# EAGLE design Adafruit IS31FL3731 STEMMA QT (EAGLE 9.6.2)
COMPANY: ADAFRUIT INDUSTRIES; DRAWN: KTOWN; REV: A
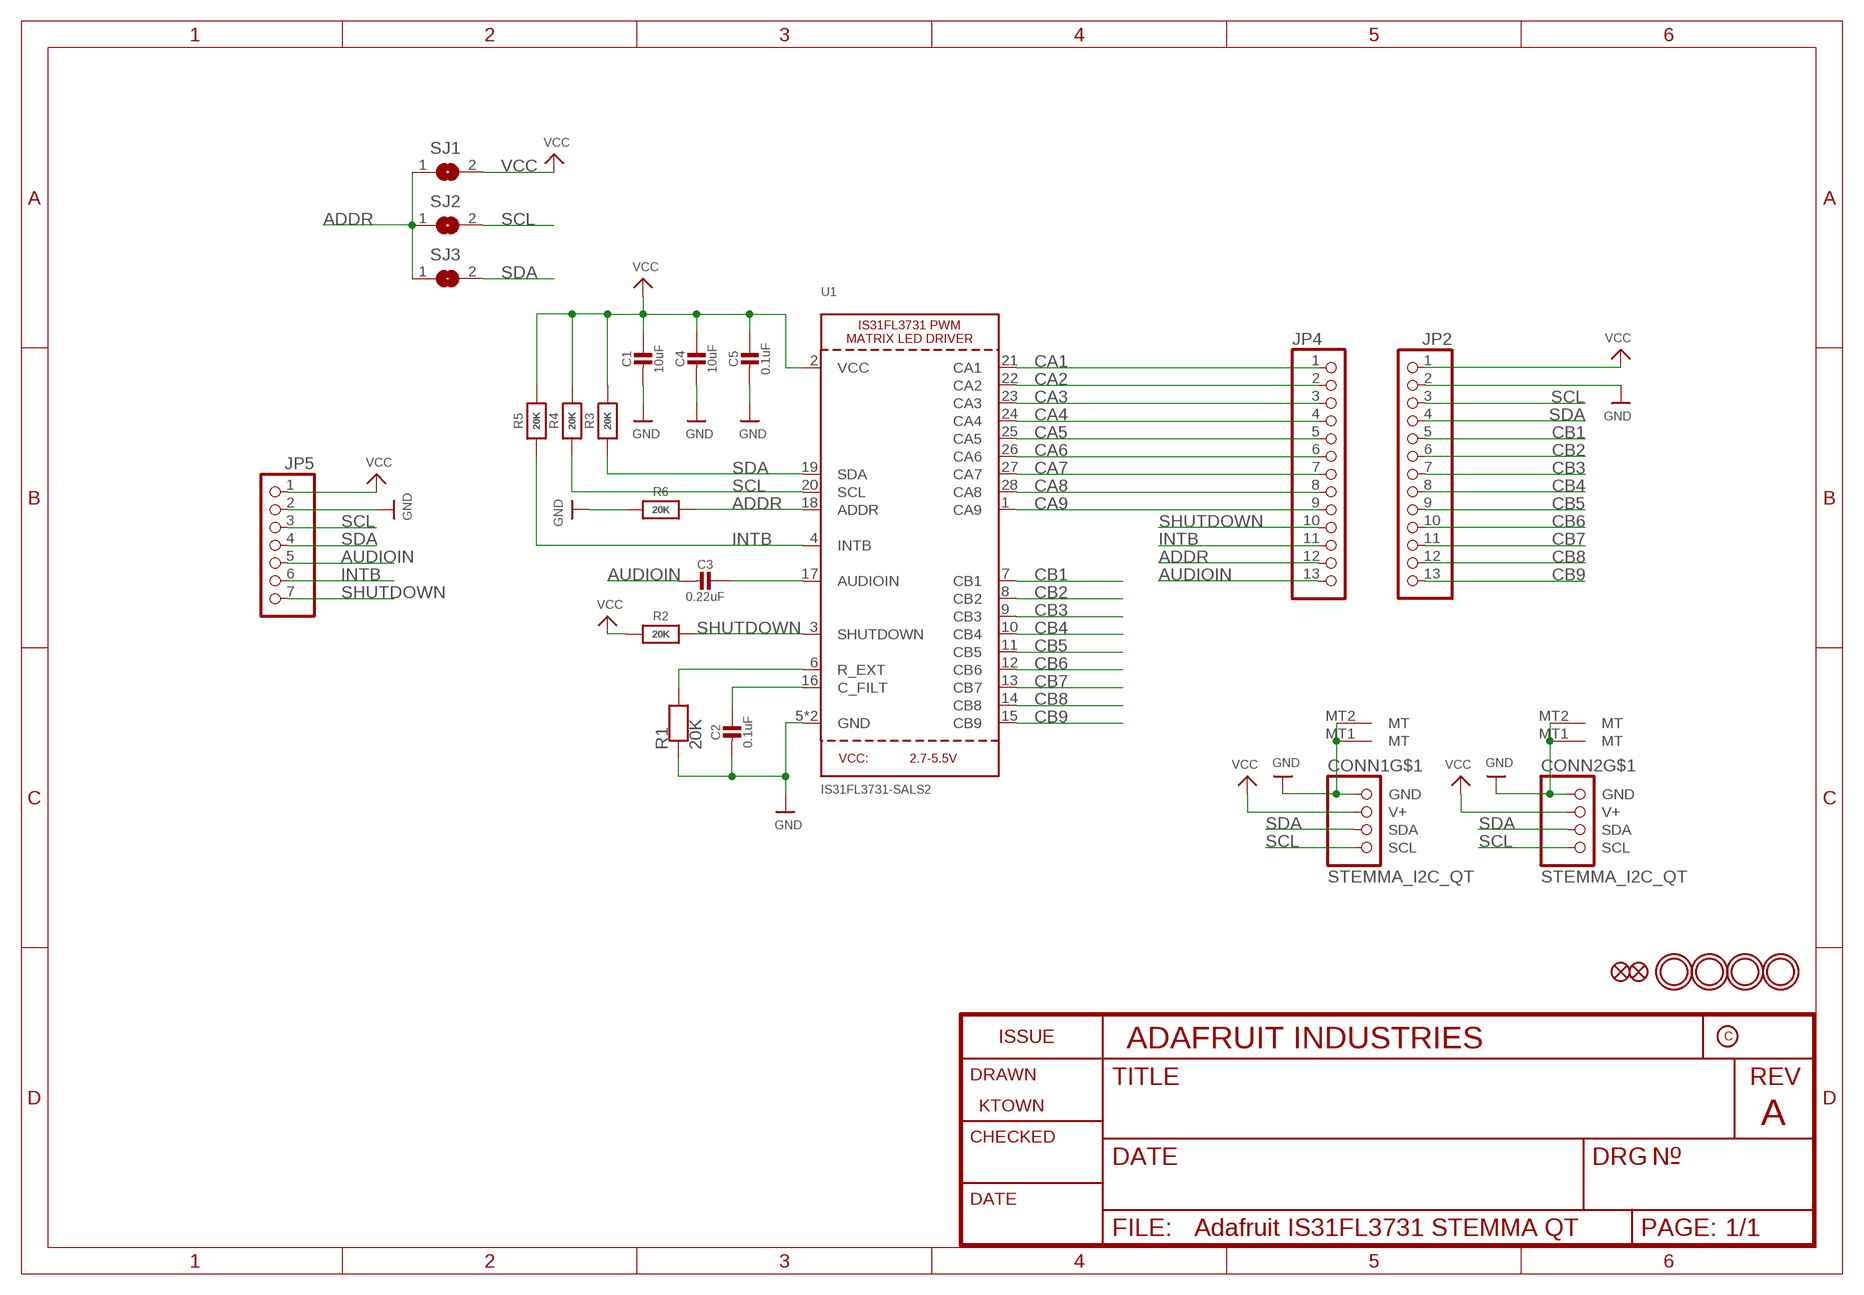
[diagram p0: schematic, sheet 1]

## Parts
C1  10uF  CAP_CERAMIC0805-NOOUTLINE  [0805-NO]
C2  0.1uF  CAP_CERAMIC0603_NO  [0603-NO]
C3  0.22uF  CAP_CERAMIC0603_NO  [0603-NO]
C4  10uF  CAP_CERAMIC0805-NOOUTLINE  [0805-NO]
C5  0.1uF  CAP_CERAMIC0603_NO  [0603-NO]
CONN1  STEMMA_I2C_QT  [JST_SH4]
CONN2  STEMMA_I2C_QT  [JST_SH4]
FID1  FIDUCIAL_1MM  [FIDUCIAL_1MM]
FID2  FIDUCIAL_1MM  [FIDUCIAL_1MM]
JP2  HEADER-1X13  [1X13_ROUND_70]
JP4  HEADER-1X13  [1X13_ROUND_70]
JP5  HEADER-1X7THICKER  [1X07_ROUND_76]
R1  20K  RESISTOR_0603THM  [0603-THM]
R2  20K  RESISTOR_0603_NOOUT  [0603-NO]
R3  20K  RESISTOR_0603_NOOUT  [0603-NO]
R4  20K  RESISTOR_0603_NOOUT  [0603-NO]
R5  20K  RESISTOR_0603_NOOUT  [0603-NO]
R6  20K  RESISTOR_0603_NOOUT  [0603-NO]
SJ1  SOLDERJUMPER  [SOLDERJUMPER_ARROW_NOPASTE]
SJ2  SOLDERJUMPER  [SOLDERJUMPER_ARROW_NOPASTE]
SJ3  SOLDERJUMPER  [SOLDERJUMPER_ARROW_NOPASTE]
U1  IS31FL3731-SALS2  IS31FL3731QFN  [QFN28_4MM_0.4MM]
U$3  MOUNTINGHOLE2.5  [MOUNTINGHOLE_2.5_PLATED]
U$4  MOUNTINGHOLE2.5  [MOUNTINGHOLE_2.5_PLATED]
U$5  MOUNTINGHOLE2.5  [MOUNTINGHOLE_2.5_PLATED]
U$6  MOUNTINGHOLE2.5  [MOUNTINGHOLE_2.5_PLATED]

## Nets
ADDR: JP4.12 R6.2 SJ1.1 SJ2.1 SJ3.1 U1.18(ADDR)
AUDIOIN: C3.2 JP4.13 JP5.5
CA1: JP4.1 U1.21(CA1)
CA2: JP4.2 U1.22(CA2)
CA3: JP4.3 U1.23(CA3)
CA4: JP4.4 U1.24(CA4)
CA5: JP4.5 U1.25(CA5)
CA6: JP4.6 U1.26(CA6)
CA7: JP4.7 U1.27(CA7)
CA8: JP4.8 U1.28(CA8)
CA9: JP4.9 U1.1(CA9)
CB1: JP2.5 U1.7(CB1)
CB2: JP2.6 U1.8(CB2)
CB3: JP2.7 U1.9(CB3)
CB4: JP2.8 U1.10(CB4)
CB5: JP2.9 U1.11(CB5)
CB6: JP2.10 U1.12(CB6)
CB7: JP2.11 U1.13(CB7)
CB8: JP2.12 U1.14(CB8)
CB9: JP2.13 U1.15(CB9)
GND: C1.2 C2.2 C4.2 C5.2 CONN1.1(GND) CONN1.MT1(MT) CONN1.MT2(MT) CONN2.1(GND) CONN2.MT1(MT) CONN2.MT2(MT) JP2.2 JP5.2 R1.1 R1.11 R6.1 U1.5(GND) U1.THERMAL(GND)
INTB: JP4.11 JP5.6 R5.1 U1.4(INTB)
N$1: C2.1 U1.16(C_FILT)
N$3: C3.1 U1.17(AUDIOIN)
REXT: R1.2 R1.22 U1.6(R_EXT)
SCL: CONN1.4(SCL) CONN2.4(SCL) JP2.3 JP5.3 R4.1 SJ2.2 U1.20(SCL)
SDA: CONN1.3(SDA) CONN2.3(SDA) JP2.4 JP5.4 R3.1 SJ3.2 U1.19(SDA)
SHUTDOWN: JP4.10 JP5.7 R2.2 U1.3(SHUTDOWN)
VCC: C1.1 C4.1 C5.1 CONN1.2(V+) CONN2.2(V+) JP2.1 JP5.1 R2.1 R3.2 R4.2 R5.2 SJ1.2 U1.2(VCC)

## Library data of the parts
C1-C5 = microbuilder:CAP_CERAMIC: Ceramic Capacitors For new designs, use the packages preceded by an '_' character since they are more reliable: The following footprints should be used on most boards: _0402 - Standard footprint for regular board layouts _0603 - Standard footprint for regular board layouts _0805 - Standard footprint for regular board layouts _1206 - Standard footprint for regular board layouts For extremely tight-pitch boards where space is at a premium, the following 'micro-pitch' footprints can be used (smaller pads, no silkscreen outline, etc.): _0402MP - Micro-pitch footprint for very dense/compact boards _0603MP - Micro-pitch footprint for very dense/compact boards _0805MP - Micro-pitch footprint for very dense/compact boards _1206MP - Micro-pitch footprint for very dense/compact boards
CONN1 CONN2 = adafruit_electromech:STEMMA_I2C; LCSC: C2845363
FID1 FID2 = microbuilder:FIDUCIAL: Fiducial Alignment Points Various fiducial points for machine vision alignment.; BOM: EXCLUDE
JP2 JP4 = microbuilder:HEADER-1X13
JP5 = microbuilder:HEADER-1X7: PIN HEADER
R1-R6 = microbuilder:RESISTOR: Resistors For new designs, use the packages preceded by an '_' character since they are more reliable: The following footprints should be used on most boards: _0402 - Standard footprint for regular board layouts _0603 - Standard footprint for regular board layouts _0805 - Standard footprint for regular board layouts _1206 - Standard footprint for regular board layouts For extremely tight-pitch boards where space is at a premium, the following 'micro-pitch' footprints can be used (smaller pads, no silkscreen outline, etc.): _0402MP - Micro-pitch footprint for very dense/compact boards _0603MP - Micro-pitch footprint for very dense/compact boards _0805MP - Micro-pitch footprint for very dense/compact boards _1206MP - Micro-pitch footprint for very dense/compact boards
SJ1-SJ3 = microbuilder:SOLDERJUMPER: SMD Solder JUMPER Solder the two pads together to create a connection, or remove the solder to break it. REFLOW - Use this footprint for solder paste and reflow ovens. WAVE - Use this footprint for hand-soldering (larger pads). CLOSED - Has a trace between the two pads to ensure it is closed by default. The trace needs to be cut to disable the jumper, and can be closed again by creating a solder bridge between the two pads.; BOM: EXCLUDE
U1 = microbuilder:IS31FL3731: IS31FL3731 PWM LED Matrix Driver; ROT: 270
U$3-U$6 = adafruit_electromech:MOUNTINGHOLE: Mounting Hole For #2 screws (0.086"/2.18mm width, 0.094"/2.4mm hole) use 2.5mm; BOM: EXCLUDE

## Board
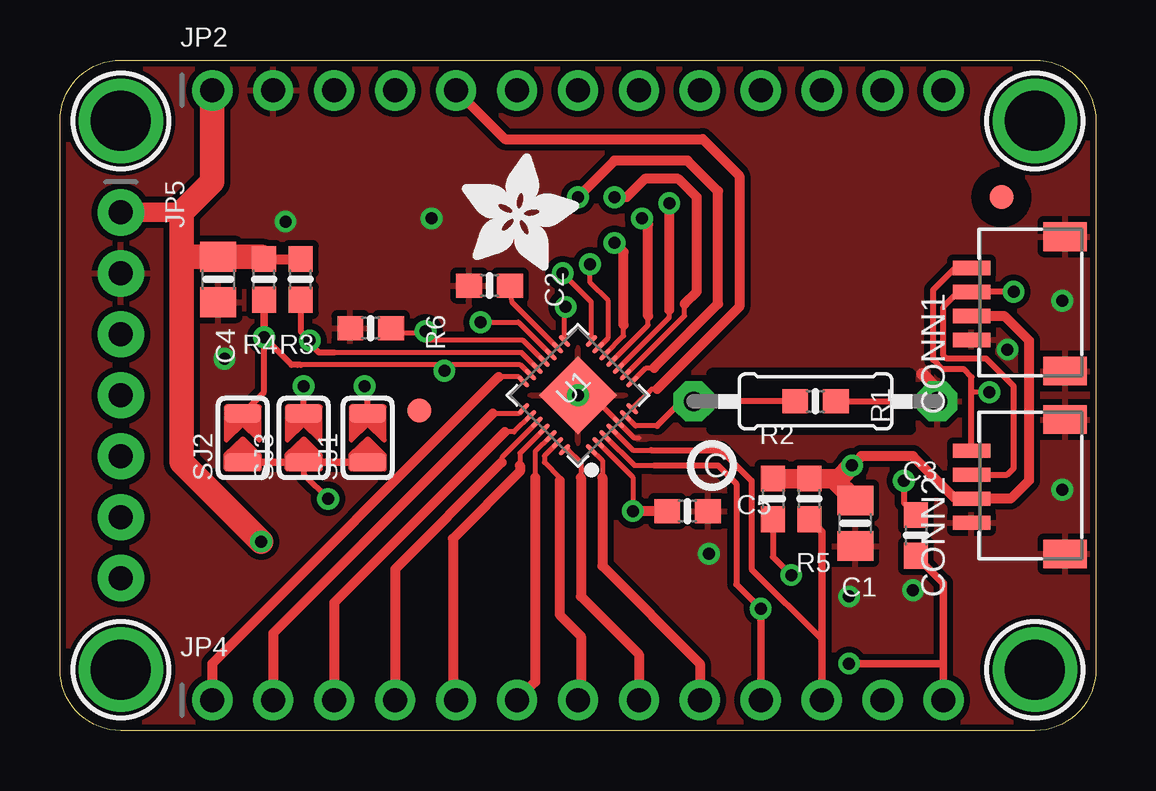
[diagram p1: board, top side]
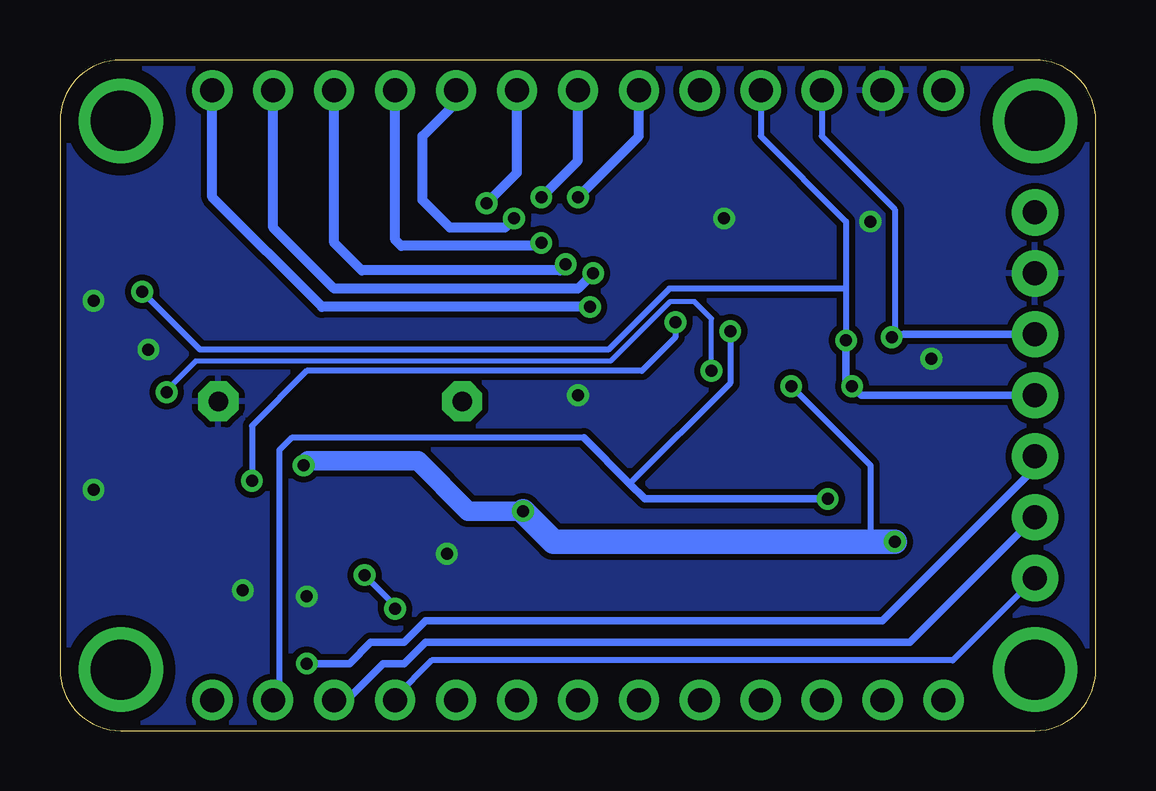
[diagram p2: board, bottom side, seen from below]

Size 43.18 x 27.94 mm. Coordinates in mm from the lower left corner, seen from the top.
Outline: 0,2.54 0,25.4 arc-90 2.54,27.94 40.64,27.94 arc-90 43.18,25.4 43.18,2.54 arc-90 40.64,0 2.54,0 arc-90 0,2.54
Copper layers (1*16): Top 0.035mm / dielectric 1.5mm / Bottom 0.035mm
Design rules "adafruit *": minimum track width 7mil, minimum drill 15.5mil, track to track 7mil, track to pad 8mil, pad to pad 8mil, via to via 8mil, smd to smd 8mil, copper to edge 10mil, drill to drill 8mil, minimum pad ring 10mil, minimum via ring 8mil, stop-mask expansion 2mil, vias tented up to drill 20mil, thermal gap 10mil
tRestrict: area 27.2,12.6 to 35.4,14.9

### Footprints (pad centres in the part's own frame; a part is rotated, then mirrored left to right if it is on the bottom)
0805-NO = smd 1.24 x 1.5: 1 -0.95,0; 2 0.95,0
0603-NO = smd 1.075 x 1: 1 -0.85,0; 2 0.85,0
JST_SH4 = smd 0.6 x 1.55: 1 -1.5,2.006; 2 -0.5,2.006; 3 0.5,2.006; 4 1.5,2.006 | smd 1.2 x 1.8: MT1 -2.8,-1.894; MT2 2.8,-1.894
FIDUCIAL_1MM = smd 1 x 1: 1 0,0
1X13_ROUND_70 = drill 1 pad 1.676: 1 -15.24,0; 2 -12.7,0; 3 -10.16,0; 4 -7.62,0; 5 -5.08,0; 6 -2.54,0; 7 0,0; 8 2.54,0; 9 5.08,0; 10 7.62,0; 11 10.16,0; 12 12.7,0; 13 15.24,0
1X07_ROUND_76 = drill 1 pad 1.93: 1 -7.62,0; 2 -5.08,0; 3 -2.54,0; 4 0,0; 5 2.54,0; 6 5.08,0; 7 7.62,0
0603-THM = drill 0.813 pad 1.676 octagon: 1 -5.08,0; 2 5.08,0 | smd 1.075 x 1: 11 -0.85,0; 22 0.85,0
SOLDERJUMPER_ARROW_NOPASTE = smd 0.762 x 1.524: 1 -1.016,0; 2 1.016,0
QFN28_4MM_0.4MM = smd 0.6 x 0.18: 1 -2,1.2; 2 -2,0.8; 3 -2,0.4; 4 -2,0; 5 -2,-0.4; 6 -2,-0.8; 7 -2,-1.2; 15 2,-1.2; 16 2,-0.8; 17 2,-0.4; 18 2,0; 19 2,0.4; 20 2,0.8; 21 2,1.2 | smd 0.18 x 0.6: 8 -1.2,-2; 9 -0.8,-2; 10 -0.4,-2; 11 0,-2; 12 0.4,-2; 13 0.8,-2; 14 1.2,-2; 22 1.2,2; 23 0.8,2; 24 0.4,2; 25 0,2; 26 -0.4,2; 27 -0.8,2; 28 -1.2,2 | smd 2.3 x 2.3: THERMAL 0,0
MOUNTINGHOLE_2.5_PLATED = drill 2.5 pad 3.2: P$1 0,0

### Placement (x,y rotation side)
C1  33.15,8.64 270 top
C2  17.91,18.54 180 top
C3  35.69,8.13 270 top
C4  6.6,18.8 270 top
C5  26.16,9.14 0 top
CONN1  40.01,17.78 90 top
CONN2  40.01,10.16 90 top
FID1  39.24,22.23 180 top
FID2  14.99,13.34 180 top
JP2  21.59,26.67 0 top
JP4  21.59,1.27 0 top
JP5  2.54,13.97 270 top
PLABEL0  [PLABEL0]  6.6,2.79 0 top
PLABEL1  [PLABEL1]  9.14,2.79 0 top
PLABEL2  [PLABEL2]  11.68,2.79 0 top
PLABEL3  [PLABEL3]  14.22,2.79 0 top
PLABEL4  [PLABEL4]  16.76,2.79 0 top
PLABEL5  [PLABEL5]  19.3,2.79 0 top
PLABEL6  [PLABEL6]  21.84,2.79 0 top
PLABEL7  [PLABEL7]  24.38,2.79 0 top
PLABEL8  [PLABEL8]  26.92,2.79 0 top
PLABEL9  [PLABEL9]  16.51,25.15 0 top
PLABEL10  [PLABEL10]  19.05,25.15 0 top
PLABEL11  [PLABEL11]  21.59,25.15 0 top
PLABEL12  [PLABEL12]  24.13,25.15 0 top
PLABEL13  [PLABEL13]  26.67,25.15 0 top
PLABEL14  [PLABEL14]  29.21,25.15 0 top
PLABEL15  [PLABEL15]  31.75,25.15 0 top
PLABEL16  [PLABEL16]  34.29,25.15 0 top
PLABEL17  [PLABEL17]  36.83,25.15 0 top
PLABEL18  [PLABEL18]  31.75,4.06 90 top
PLABEL19  [PLABEL19]  29.21,4.83 90 top
PLABEL20  [PLABEL20]  36.83,4.7 90 top
PLABEL21  [PLABEL21]  34.29,4.32 90 top
PLABEL22  [PLABEL22]  30.61,19.43 0 top
PLABEL23  [PLABEL23]  5.71,25.65 270 top
PLABEL24  [PLABEL24]  8.38,25.65 270 top
PLABEL25  [PLABEL25]  10.92,25.65 270 top
PLABEL26  [PLABEL26]  13.46,25.65 270 top
PLABEL27  [PLABEL27]  4.83,20.07 90 top
PLABEL28  [PLABEL28]  1.27,17.27 90 top
PLABEL29  [PLABEL29]  4.83,15.11 90 top
PLABEL30  [PLABEL30]  1.27,12.7 90 top
PLABEL31  [PLABEL31]  4.32,11.68 90 top
PLABEL32  [PLABEL32]  0.76,9.02 90 top
PLABEL33  [PLABEL33]  4.57,6.35 90 top
PLABEL34  [PLABEL34]  19.68,7.37 0 top
PLABEL35  [PLABEL35]  10.67,6.73 90 top
PLABEL36  [PLABEL36]  8.13,6.73 90 top
PLABEL37  [PLABEL37]  13.34,6.73 90 top
PLABEL38  [PLABEL38]  30.1,11.43 0 top
PLABEL39  [PLABEL39]  7.62,14.22 0 top
R1  31.5,13.72 180 top
R2  29.72,9.65 270 top
R3  10.03,18.8 90 top
R4  8.51,18.8 90 top
R5  31.24,9.65 90 top
R6  12.95,16.76 0 top
SJ1  12.83,12.19 90 top
SJ2  7.62,12.19 90 top
SJ3  10.16,12.19 90 top
U1  21.59,13.97 135 top
U$3  2.54,2.54 180 top
U$4  40.64,2.54 180 top
U$5  2.54,25.4 180 top
U$6  40.64,25.4 180 top
U$10  [ADAFRUIT_5MM]  16.76,19.18 0 top
U$11  [PCBFEAT-REV-040]  27.18,11.05 0 top

### Tracks (layer width: path | path; a pad name or v marks a point on that pad's centre or on a via)
ADDR  (via drill 0.5)
  Top 0.203: U1.18 19.3,16.26 15.24,16.26 v15.24,16.64 15.24,16.55 14.02,16.55 R6.2
  Top 0.254: SJ3.1 10.16,10.67 v11.18,9.65
  Top 0.305: SJ1.1 SJ3.1 SJ2.1
  Bottom 0.254: v15.24,16.64 15.24,14.48 19.43,10.29 | JP4.12 34.04,1.52 34.04,11.68 33.53,12.19 21.34,12.19
  Bottom 0.305: v11.18,9.65 18.8,9.65 19.43,10.29 21.34,12.19
AUDIOIN  (via drill 0.5)
  Top 0.305: C3.2 36.83,6.13 36.83,2.79 | v32.89,2.79 36.83,2.79 | 36.83,2.79 JP4.13
  Bottom 0.305: JP5.5 2.54,10.92 8.89,4.57 27.94,4.57 28.83,3.68 30.23,3.68 31.11,2.79 v32.89,2.79
CA1
  Top 0.203: U1.21 19.13,14.73 18.29,14.73
  Top 0.254: 6.35,1.56 JP4.1
  Top 0.406: 18.29,14.73 6.35,2.79 JP4.1
CA2
  Top 0.203: U1.22 19.13,13.21 18.03,13.21
  Top 0.254: 8.89,2.97 JP4.2
  Top 0.406: 18.03,13.21 8.89,4.06 JP4.2
CA3
  Top 0.203: U1.23 18.93,12.45 18.54,12.45
  Top 0.254: 11.43,4.94 JP4.3
  Top 0.406: 18.54,12.45 11.43,5.33 JP4.3
CA4
  Top 0.203: U1.24 18.41,11.36 18.41,11.18
  Top 0.406: 18.41,11.18 13.97,6.73 JP4.4
CA5
  Top 0.203: U1.25 19.18,11.56 19.18,11.05
  Top 0.406: 19.18,11.05 19.18,10.79 16.38,8 16.38,1.4 JP4.5
CA6
  Top 0.203: U1.26 19.81,11.63 19.81,10.54
  Top 0.406: 19.81,10.54 19.81,2.03 JP4.6
CA7
  Top 0.203: U1.27 20.19,11.44 20.19,11.18 20.83,10.54 20.83,10.41
  Top 0.406: 20.83,10.41 20.83,4.83 21.72,3.94 21.72,1.4 JP4.7
CA8
  Top 0.203: U1.28 21.19,11.71 21.72,11.18 21.72,10.54
  Top 0.406: 21.72,10.54 21.72,5.59 24.13,3.17 JP4.8
CA9
  Top 0.203: U1.1 22.61,11.26 22.61,10.54
  Top 0.406: 22.61,10.54 22.61,6.86 26.67,2.79 JP4.9
CB1
  Top 0.203: 24.89,14.22 24.67,14.22 U1.7
  Top 0.406: JP2.5 18.54,24.64 26.8,24.64 28.32,23.11 28.32,17.65 24.89,14.22
CB2  (via drill 0.5)
  Top 0.203: U1.8 24.43,15.11 24.77,15.11
  Top 0.406: 24.77,15.11 27.43,17.78 27.43,22.48 26.16,23.75 23.11,23.75 v21.59,22.23
  Bottom 0.406: v21.59,22.23 19.05,24.77 JP2.6
CB3  (via drill 0.5)
  Top 0.203: U1.9 26.04,17.28 26.04,17.78
  Top 0.406: 26.04,17.78 26.54,18.29 26.54,22.23 25.78,22.99 24.38,22.99 23.62,22.23 v23.11,22.23
  Bottom 0.406: v23.11,22.23 21.59,23.75 JP2.7
CB4  (via drill 0.5)
  Top 0.203: U1.10 25.4,17.21 25.4,17.53
  Top 0.406: 25.4,17.53 v25.4,21.97
  Bottom 0.406: v25.4,21.97 24.13,23.24 JP2.8
CB5  (via drill 0.5)
  Top 0.203: U1.11 24.51,16.89 24.51,17.27
  Top 0.406: 24.51,17.27 24.51,21.08 v24.26,21.34
  Bottom 0.406: v24.26,21.34 24.64,20.95 26.92,20.95 28.07,22.1 28.07,24.77 26.67,26.16 JP2.9
CB6  (via drill 0.5)
  Top 0.203: U1.12 23.5,16.44 23.5,16.89
  Top 0.406: 23.5,16.89 23.5,19.94 v23.11,20.32
  Bottom 0.406: v23.11,20.32 23.24,20.19 28.96,20.19 29.21,20.45 JP2.10
CB7  (via drill 0.5)
  Top 0.203: U1.13 22.86,16.37 22.86,17.91 22.1,18.67 v22.1,19.43
  Bottom 0.406: v22.1,19.43 22.35,19.18 30.61,19.18 31.75,20.32 JP2.11
CB8  (via drill 0.5)
  Top 0.203: U1.14 22.16,17.85 v20.95,19.05
  Bottom 0.406: v20.95,19.05 21.59,18.41 31.75,18.41 34.29,20.95 JP2.12
CB9  (via drill 0.5)
  Top 0.203: U1.15 21.02,17.59 v21.08,17.65
  Bottom 0.406: v21.08,17.65 32.26,17.65 36.83,22.23 JP2.13
GND  (via drill 0.5)
  Top 0.203: U1.THERMAL 22.16,13.97 U1.5 23.93,12.19 24.13,12.19
  Top 0.254: R1.11 R1.1 | 35.94,14.86 35.94,14.99
  Top 0.508: R1.1 36.58,14.22 35.94,14.86
  other vias: 21.59,13.97 15.49,21.34 9.4,21.21 32.89,5.59 27.05,7.37 6.86,15.49 39.5,15.88 41.78,17.91 41.78,10.03 35.56,5.84
  pour Top (isolate 0.254): 43.18,27.94 43.18,0 0,0 0,27.94
  pour Bottom (isolate 0.254): 0,27.94 43.18,27.94 43.18,0 0,0
INTB
  Top 0.203: U1.4 23.88,11.68 24.64,11.68
  Top 0.254: 24.64,11.68 27.56,11.68 28.83,10.41 28.83,6.73 31.75,3.81
  Top 0.305: JP4.11 31.75,3.81 31.75,8.29 R5.1
  Bottom 0.305: JP5.6 7.75,3.68 27.94,3.68 28.83,2.79 29.72,2.79 31.24,1.27 | 31.11,1.27 31.24,1.27 | 31.24,1.27 JP4.11
N$1
  Top 0.203: U1.16 18.84,17.85 C2.1
N$3  (via drill 0.5)
  Top 0.203: v17.53,17.02 19.11,17.02 U1.17
  Top 0.254: v35.18,10.41 35.18,9.49 C3.1
  Bottom 0.254: v35.18,10.41 35.18,12.7 32.89,14.99 18.92,14.99 17.53,16.38 v17.53,17.02
REXT
  Top 0.203: U1.6 23.99,12.7 24.89,12.7
  Top 0.254: 24.89,12.7 25.91,13.72 R1.2 R1.22
SCL  (via drill 0.5)
  Top 0.203: U1.20 19.19,15.24 16.13,15.24 | 16.13,15.24 9.91,15.24 | 16.13,15.24 16.13,15.1 v16.02,14.99 | v38.73,14.1 38,14.1
  Top 0.254: 10.03,15.24 9.91,15.24 9.65,15.24 v8.51,16.38 8.51,14.1 SJ2.2 | CONN2.4 38,14.1 38,14.73 37.67,15.06 36.78,15.06 36.4,15.44 36.4,18.36 37.34,19.3 37.98,19.3 CONN1.4
  Top 0.305: v8.51,16.38 R4.1
  Bottom 0.203: v16.02,14.99 16.02,17.17 16.73,17.87 17.75,17.87 20.23,15.39 37.53,15.39 38.73,14.19 v38.73,14.1
  Bottom 0.254: 8,16.51 8.38,16.51 | JP2.3 11.43,24.77 8.38,21.72 8.38,16.51 | 8.38,16.51 v8.51,16.38
  Bottom 0.305: JP5.3 8,16.51
SDA  (via drill 0.5)
  Top 0.203: U1.19 19.25,15.75 11.43,15.75
  Top 0.254: 11.43,15.75 10.79,15.75 10.41,16.13 v10.41,16.26 10.03,16.64 R3.1 | SJ3.2 v10.16,14.35 | CONN2.3 39.49,10.66 39.75,10.92 39.75,14.35 38.61,15.49 36.96,15.49 36.83,15.62 36.83,17.65 37.46,18.28 CONN1.3 v39.74,18.28 v39.75,18.29
  Bottom 0.254: JP2.4 13.97,24.77 10.41,21.21 10.41,18.41 | 10.41,18.41 v10.41,16.26 | 10.41,18.41 17.78,18.41 20.32,15.88 37.34,15.88 v39.75,18.29
  Bottom 0.305: JP5.4 9.78,13.97 v10.16,14.35 10.41,14.61 v10.41,16.26
SHUTDOWN  (via drill 0.5)
  Top 0.203: U1.3 23.95,11.05 24.77,11.05
  Top 0.254: 24.77,11.05 27.43,11.05 28.19,10.29 28.19,6.1 v29.21,5.08 | v30.48,6.48 29.72,7.24 R2.2
  Top 0.305: JP4.10 v29.21,5.08
  Bottom 0.254: v30.48,6.48 29.21,5.21 v29.21,5.08 | JP5.7 5.97,2.92 27.69,2.92 29.21,1.4 JP4.10
VCC  (via drill 0.5)
  Top 0.203: U1.2 23.88,10.55 v23.88,9.14
  Top 0.254: C5.1 25.09,9.14 | SJ1.2 12.83,14.22 v12.7,14.35
  Top 0.305: 5.33,13.21 5.08,13.46
  Top 0.406: R4.2 R3.2 | 25.09,9.14 v23.88,9.14 | v33.02,11.05 33.4,11.43 35.56,11.43 37.33,9.66 CONN2.2 39.63,9.66 40.39,10.41 40.39,16.26 39.36,17.28 CONN1.2
  Top 0.813: v33.02,11.05 32.47,10.5 R5.2 | JP5.1 4.95,21.59 5.08,21.46 | R5.2 R2.1 | 5.34,21.78 5.27,21.78 | C1.1 32.23,10.5 R5.2
  Top 1.016: v8.38,7.87 5.08,11.18 5.08,13.46 5.08,19.75 | 5.08,19.75 5.08,21.46 5.08,21.59 5.27,21.78 6.35,22.86 JP2.1 | R4.2 8.41,19.75 C4.1 5.08,19.75
  Bottom 0.254: v12.7,14.35 9.4,11.05 9.4,7.87
  Bottom 0.813: v23.88,9.14 26.16,9.14 28.25,11.24 32.83,11.24 v33.02,11.05
  Bottom 1.016: v8.38,7.87 9.4,7.87 22.61,7.87 v23.88,9.14

### Text on the board
Pinguin_tBackup: VCC | GND | SCL | SDA | B1 | B2 | B3 | B4 | B5 | B6 | B7 | B8 | B9 | VCC | GND | IS31FL3731 / PWM LED / I2C Driver | SCL | SDA | I2C addr | AUD | Rext | INTB | 0x75 | 0x76 | 0x77 | 9x16 LED / Matrix Driver / Vcc: 2.7-5.5V | !SD | !SHUTD | AUDIO | INTB | ADDR | A1 | A2 | A3 | A4 | A5 | A6 | A7 | A8 | A9